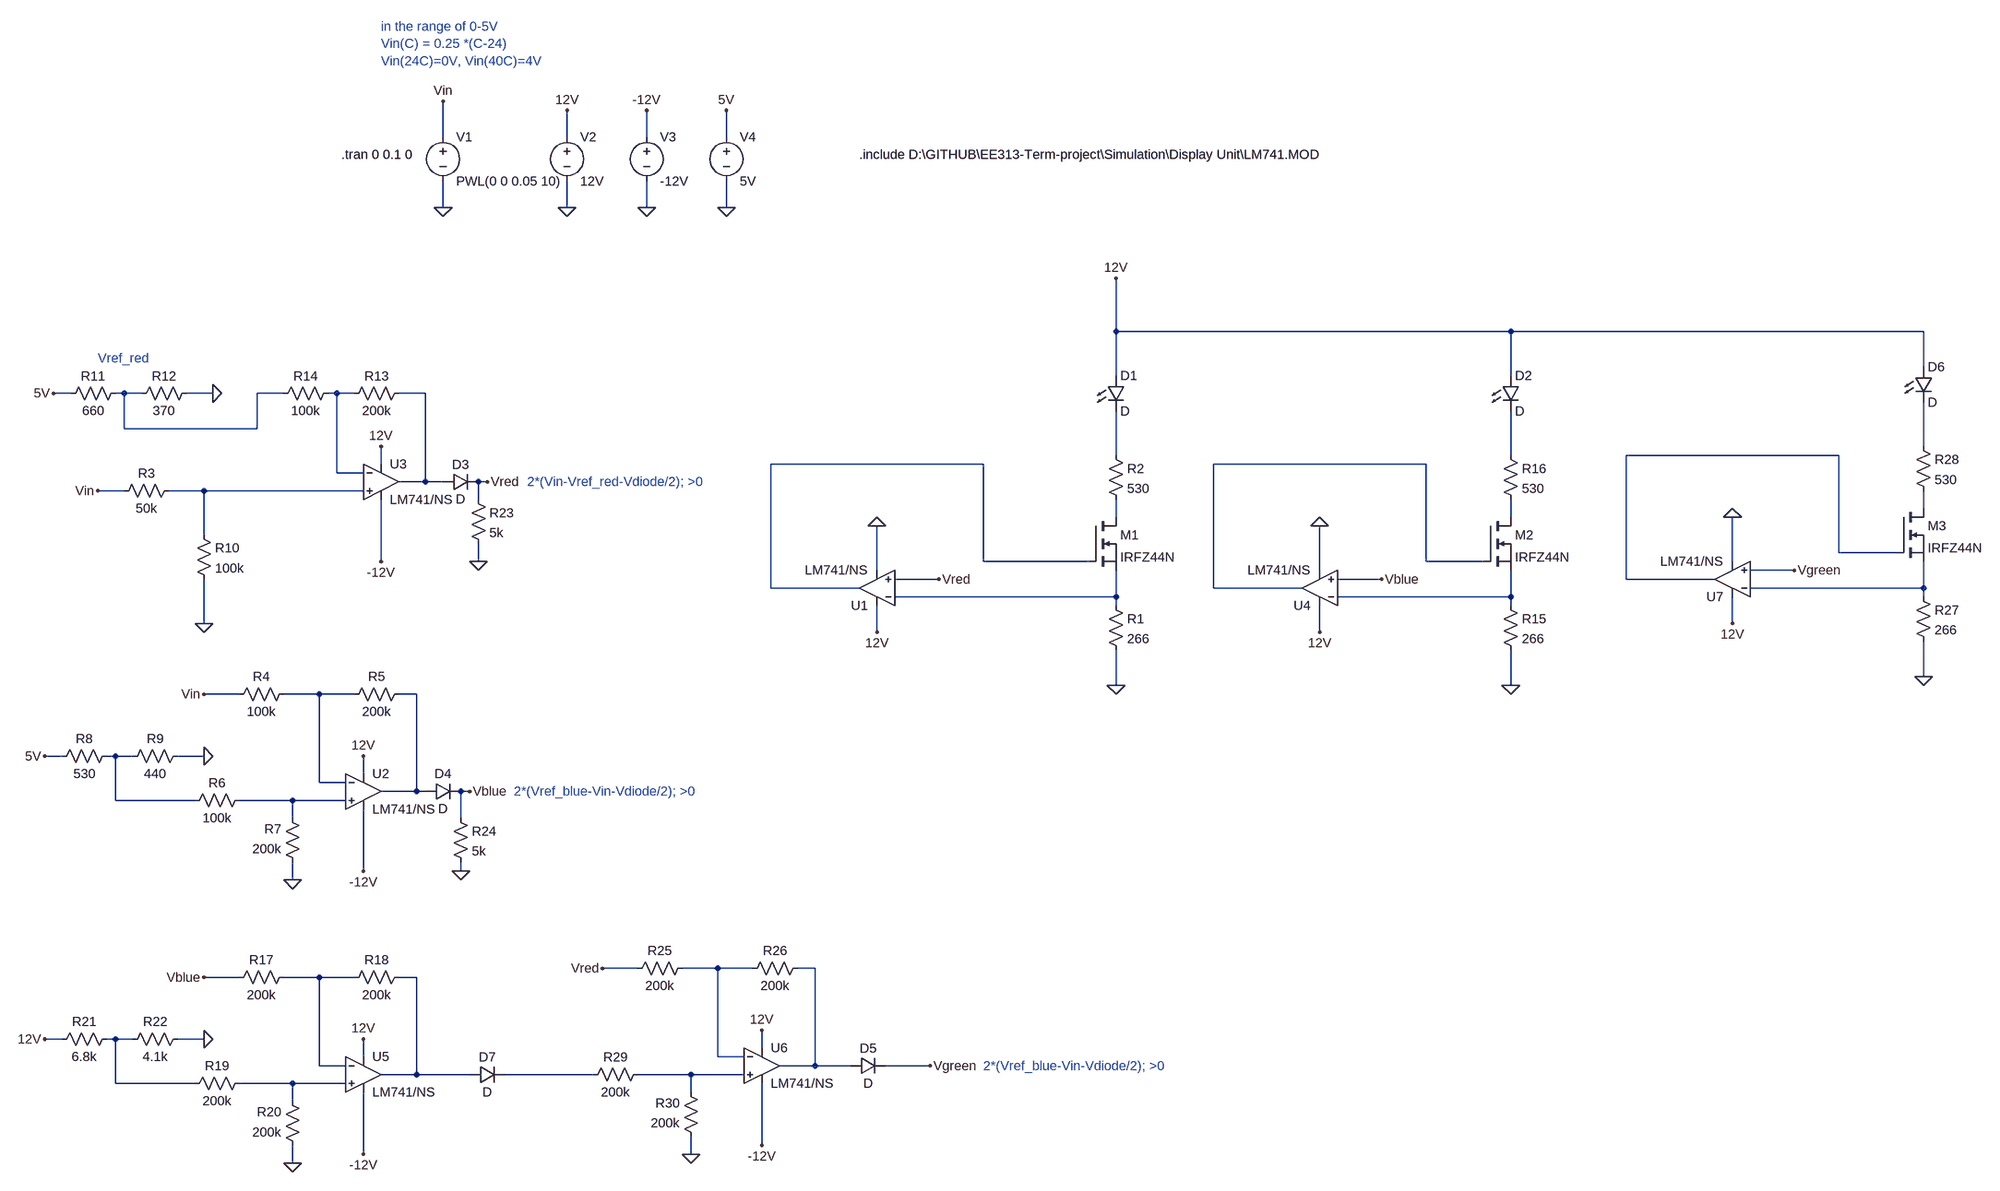
[diagram p0: schematic Display Unit.asc]
Display Unit.asc, the LTspice schematic file:
Version 4
SHEET 1 4272 2752
WIRE -912 320 -912 256
WIRE -688 320 -688 272
WIRE -544 320 -544 272
WIRE -400 320 -400 272
WIRE -912 448 -912 400
WIRE -688 448 -688 400
WIRE -544 448 -544 400
WIRE -400 448 -400 400
WIRE 304 672 304 576
WIRE 1104 672 304 672
WIRE 2000 672 1104 672
WIRE 2000 736 2000 672
WIRE 304 752 304 672
WIRE 1104 752 1104 672
WIRE -1584 784 -1616 784
WIRE -1488 784 -1504 784
WIRE -1456 784 -1488 784
WIRE -1328 784 -1376 784
WIRE -1200 784 -1248 784
WIRE -1104 784 -1120 784
WIRE -1072 784 -1104 784
WIRE -944 784 -992 784
WIRE -1488 848 -1488 784
WIRE -1248 848 -1248 784
WIRE -1248 848 -1488 848
WIRE 2000 880 2000 800
WIRE 304 896 304 816
WIRE 1104 896 1104 816
WIRE 1760 896 1376 896
WIRE -1024 912 -1024 880
WIRE 64 912 -320 912
WIRE 864 912 480 912
WIRE -1104 928 -1104 784
WIRE -1056 928 -1104 928
WIRE -944 944 -944 784
WIRE -944 944 -992 944
WIRE -912 944 -944 944
WIRE -832 944 -848 944
WIRE -1488 960 -1536 960
WIRE -1344 960 -1408 960
WIRE -1056 960 -1344 960
WIRE -848 976 -848 944
WIRE 2000 992 2000 960
WIRE 304 1008 304 976
WIRE 1104 1008 1104 976
WIRE -1344 1040 -1344 960
WIRE 1760 1072 1760 896
WIRE 1952 1072 1760 1072
WIRE -1024 1088 -1024 976
WIRE -848 1088 -848 1056
WIRE 64 1088 64 912
WIRE 256 1088 64 1088
WIRE 864 1088 864 912
WIRE 1056 1088 864 1088
WIRE 1568 1088 1568 1008
WIRE -128 1104 -128 1024
WIRE 672 1104 672 1024
WIRE 1680 1104 1600 1104
WIRE -16 1120 -96 1120
WIRE 784 1120 704 1120
WIRE 1376 1120 1376 896
WIRE 1536 1120 1376 1120
WIRE -320 1136 -320 912
WIRE -160 1136 -320 1136
WIRE 480 1136 480 912
WIRE 640 1136 480 1136
WIRE 2000 1136 2000 1088
WIRE 2000 1136 1600 1136
WIRE 304 1152 304 1104
WIRE 304 1152 -96 1152
WIRE 1104 1152 1104 1104
WIRE 1104 1152 704 1152
WIRE 2000 1152 2000 1136
WIRE 304 1168 304 1152
WIRE 1104 1168 1104 1152
WIRE -1344 1200 -1344 1120
WIRE 1568 1200 1568 1152
WIRE -128 1216 -128 1168
WIRE 672 1216 672 1168
WIRE 2000 1296 2000 1232
WIRE 304 1312 304 1248
WIRE 1104 1312 1104 1248
WIRE -1280 1328 -1344 1328
WIRE -1136 1328 -1200 1328
WIRE -1072 1328 -1136 1328
WIRE -960 1328 -992 1328
WIRE -1600 1440 -1632 1440
WIRE -1504 1440 -1520 1440
WIRE -1472 1440 -1504 1440
WIRE -1344 1440 -1392 1440
WIRE -1056 1472 -1056 1440
WIRE -1136 1488 -1136 1328
WIRE -1088 1488 -1136 1488
WIRE -960 1504 -960 1328
WIRE -960 1504 -1024 1504
WIRE -944 1504 -960 1504
WIRE -864 1504 -880 1504
WIRE -1504 1520 -1504 1440
WIRE -1360 1520 -1504 1520
WIRE -1184 1520 -1280 1520
WIRE -1088 1520 -1184 1520
WIRE -1184 1552 -1184 1520
WIRE -880 1552 -880 1504
WIRE -1056 1648 -1056 1536
WIRE -880 1648 -880 1632
WIRE -1184 1664 -1184 1632
WIRE -560 1824 -624 1824
WIRE -416 1824 -480 1824
WIRE -352 1824 -416 1824
WIRE -240 1824 -272 1824
WIRE -1280 1840 -1344 1840
WIRE -1136 1840 -1200 1840
WIRE -1072 1840 -1136 1840
WIRE -960 1840 -992 1840
WIRE -1600 1952 -1632 1952
WIRE -1504 1952 -1520 1952
WIRE -1472 1952 -1504 1952
WIRE -1344 1952 -1392 1952
WIRE -336 1968 -336 1936
WIRE -1056 1984 -1056 1952
WIRE -416 1984 -416 1824
WIRE -368 1984 -416 1984
WIRE -1136 2000 -1136 1840
WIRE -1088 2000 -1136 2000
WIRE -240 2000 -240 1824
WIRE -240 2000 -304 2000
WIRE -176 2000 -240 2000
WIRE -32 2000 -112 2000
WIRE -960 2016 -960 1840
WIRE -960 2016 -1024 2016
WIRE -864 2016 -960 2016
WIRE -640 2016 -800 2016
WIRE -464 2016 -560 2016
WIRE -368 2016 -464 2016
WIRE -1504 2032 -1504 1952
WIRE -1360 2032 -1504 2032
WIRE -1184 2032 -1280 2032
WIRE -1088 2032 -1184 2032
WIRE -464 2048 -464 2016
WIRE -1184 2064 -1184 2032
WIRE -336 2144 -336 2032
WIRE -1056 2160 -1056 2048
WIRE -464 2160 -464 2128
WIRE -1184 2176 -1184 2144
FLAG -912 448 0
FLAG -912 256 Vin
FLAG -128 1216 12V
FLAG -688 448 0
FLAG -688 272 12V
FLAG 304 576 12V
FLAG 304 1312 0
FLAG -16 1120 Vred
FLAG -544 448 0
FLAG -544 272 -12V
FLAG -400 448 0
FLAG -400 272 5V
FLAG -1024 880 12V
FLAG -1344 1200 0
FLAG -832 944 Vred
FLAG -1616 784 5V
FLAG -1328 784 0
FLAG -1536 960 Vin
FLAG -1056 1440 12V
FLAG -864 1504 Vblue
FLAG -128 1024 0
FLAG 672 1216 12V
FLAG 1104 1312 0
FLAG 784 1120 Vblue
FLAG 672 1024 0
FLAG -1184 1664 0
FLAG -1344 1328 Vin
FLAG -1024 1088 -12V
FLAG -1056 1648 -12V
FLAG -1632 1440 5V
FLAG -1344 1440 0
FLAG 1568 1200 12V
FLAG 2000 1296 0
FLAG 1680 1104 Vgreen
FLAG 1568 1008 0
FLAG -1056 1952 12V
FLAG -32 2000 Vgreen
FLAG -1184 2176 0
FLAG -624 1824 Vred
FLAG -1056 2160 -12V
FLAG -1632 1952 12V
FLAG -1344 1952 0
FLAG -848 1088 0
FLAG -880 1648 0
FLAG -336 1936 12V
FLAG -464 2160 0
FLAG -1344 1840 Vblue
FLAG -336 2144 -12V
SYMBOL voltage -912 304 R0
WINDOW 123 0 0 Left 0
WINDOW 39 0 0 Left 0
SYMATTR InstName V1
SYMATTR Value PWL(0 0 0.05 10)
SYMBOL OpAmps\\opamp2 -128 1200 R180
SYMATTR InstName U1
SYMATTR Value LM741/NS
SYMBOL voltage -688 304 R0
WINDOW 123 0 0 Left 0
WINDOW 39 0 0 Left 0
SYMATTR InstName V2
SYMATTR Value 12V
SYMBOL LED 288 752 R0
SYMATTR InstName D1
SYMBOL res 288 1152 R0
SYMATTR InstName R1
SYMATTR Value 266
SYMBOL res 288 880 R0
SYMATTR InstName R2
SYMATTR Value 530
SYMBOL voltage -544 304 R0
WINDOW 123 0 0 Left 0
WINDOW 39 0 0 Left 0
SYMATTR InstName V3
SYMATTR Value -12V
SYMBOL voltage -400 304 R0
WINDOW 123 0 0 Left 0
WINDOW 39 0 0 Left 0
SYMATTR InstName V4
SYMATTR Value 5V
SYMBOL OpAmps\\opamp2 -1024 880 R0
SYMATTR InstName U3
SYMATTR Value LM741/NS
SYMBOL res -1360 1024 R0
SYMATTR InstName R10
SYMATTR Value 100k
SYMBOL res -976 768 R90
WINDOW 0 0 56 VBottom 2
WINDOW 3 32 56 VTop 2
SYMATTR InstName R13
SYMATTR Value 200k
SYMBOL res -1216 800 R270
WINDOW 0 32 56 VTop 2
WINDOW 3 0 56 VBottom 2
SYMATTR InstName R14
SYMATTR Value 100k
SYMBOL res -1488 768 R90
WINDOW 0 0 56 VBottom 2
WINDOW 3 32 56 VTop 2
SYMATTR InstName R11
SYMATTR Value 660
SYMBOL res -1360 768 R90
WINDOW 0 0 56 VBottom 2
WINDOW 3 32 56 VTop 2
SYMATTR InstName R12
SYMATTR Value 370
SYMBOL res -1392 944 R90
WINDOW 0 0 56 VBottom 2
WINDOW 3 32 56 VTop 2
SYMATTR InstName R3
SYMATTR Value 50k
SYMBOL OpAmps\\opamp2 -1056 1440 R0
SYMATTR InstName U2
SYMATTR Value LM741/NS
SYMBOL nmos 256 1008 R0
SYMATTR InstName M1
SYMATTR Value IRFZ44N
SYMBOL OpAmps\\opamp2 672 1200 R180
SYMATTR InstName U4
SYMATTR Value LM741/NS
SYMBOL LED 1088 752 R0
SYMATTR InstName D2
SYMBOL res 1088 1152 R0
SYMATTR InstName R15
SYMATTR Value 266
SYMBOL res 1088 880 R0
SYMATTR InstName R16
SYMATTR Value 530
SYMBOL nmos 1056 1008 R0
SYMATTR InstName M2
SYMATTR Value IRFZ44N
SYMBOL res -1184 1312 R90
WINDOW 0 0 56 VBottom 2
WINDOW 3 32 56 VTop 2
SYMATTR InstName R4
SYMATTR Value 100k
SYMBOL res -976 1312 R90
WINDOW 0 0 56 VBottom 2
WINDOW 3 32 56 VTop 2
SYMATTR InstName R5
SYMATTR Value 200k
SYMBOL res -1264 1504 R90
WINDOW 0 0 56 VBottom 2
WINDOW 3 32 56 VTop 2
SYMATTR InstName R6
SYMATTR Value 100k
SYMBOL res -1168 1648 R180
WINDOW 0 36 76 Left 2
WINDOW 3 36 40 Left 2
SYMATTR InstName R7
SYMATTR Value 200k
SYMBOL diode -912 960 R270
WINDOW 0 32 32 VTop 2
WINDOW 3 0 32 VBottom 2
SYMATTR InstName D3
SYMBOL diode -944 1520 R270
WINDOW 0 32 32 VTop 2
WINDOW 3 0 32 VBottom 2
SYMATTR InstName D4
SYMBOL res -1504 1424 R90
WINDOW 0 0 56 VBottom 2
WINDOW 3 32 56 VTop 2
SYMATTR InstName R8
SYMATTR Value 530
SYMBOL res -1376 1424 R90
WINDOW 0 0 56 VBottom 2
WINDOW 3 32 56 VTop 2
SYMATTR InstName R9
SYMATTR Value 440
SYMBOL OpAmps\\opamp2 1568 1184 R180
SYMATTR InstName U7
SYMATTR Value LM741/NS
SYMBOL LED 1984 736 R0
SYMATTR InstName D6
SYMBOL res 1984 1136 R0
SYMATTR InstName R27
SYMATTR Value 266
SYMBOL res 1984 864 R0
SYMATTR InstName R28
SYMATTR Value 530
SYMBOL nmos 1952 992 R0
SYMATTR InstName M3
SYMATTR Value IRFZ44N
SYMBOL OpAmps\\opamp2 -1056 1952 R0
SYMATTR InstName U5
SYMATTR Value LM741/NS
SYMBOL res -1184 1824 R90
WINDOW 0 0 56 VBottom 2
WINDOW 3 32 56 VTop 2
SYMATTR InstName R17
SYMATTR Value 200k
SYMBOL res -976 1824 R90
WINDOW 0 0 56 VBottom 2
WINDOW 3 32 56 VTop 2
SYMATTR InstName R18
SYMATTR Value 200k
SYMBOL res -1264 2016 R90
WINDOW 0 0 56 VBottom 2
WINDOW 3 32 56 VTop 2
SYMATTR InstName R19
SYMATTR Value 200k
SYMBOL res -1168 2160 R180
WINDOW 0 36 76 Left 2
WINDOW 3 36 40 Left 2
SYMATTR InstName R20
SYMATTR Value 200k
SYMBOL res -1504 1936 R90
WINDOW 0 0 56 VBottom 2
WINDOW 3 32 56 VTop 2
SYMATTR InstName R21
SYMATTR Value 6.8k
SYMBOL res -1376 1936 R90
WINDOW 0 0 56 VBottom 2
WINDOW 3 32 56 VTop 2
SYMATTR InstName R22
SYMATTR Value 4.1k
SYMBOL res -864 960 R0
SYMATTR InstName R23
SYMATTR Value 5k
SYMBOL res -896 1536 R0
SYMATTR InstName R24
SYMATTR Value 5k
SYMBOL OpAmps\\opamp2 -336 1936 R0
SYMATTR InstName U6
SYMATTR Value LM741/NS
SYMBOL res -464 1808 R90
WINDOW 0 0 56 VBottom 2
WINDOW 3 32 56 VTop 2
SYMATTR InstName R25
SYMATTR Value 200k
SYMBOL res -256 1808 R90
WINDOW 0 0 56 VBottom 2
WINDOW 3 32 56 VTop 2
SYMATTR InstName R26
SYMATTR Value 200k
SYMBOL res -544 2000 R90
WINDOW 0 0 56 VBottom 2
WINDOW 3 32 56 VTop 2
SYMATTR InstName R29
SYMATTR Value 200k
SYMBOL res -448 2144 R180
WINDOW 0 36 76 Left 2
WINDOW 3 36 40 Left 2
SYMATTR InstName R30
SYMATTR Value 200k
SYMBOL diode -176 2016 R270
WINDOW 0 32 32 VTop 2
WINDOW 3 0 32 VBottom 2
SYMATTR InstName D5
SYMBOL diode -864 2032 R270
WINDOW 0 32 32 VTop 2
WINDOW 3 0 32 VBottom 2
SYMATTR InstName D7
TEXT -160 352 Left 2 !.include D:\\GITHUB\\EE313-Term-project\\Simulation\\Display Unit\\LM741.MOD
TEXT -1096 352 Left 2 !.tran 0 0.1 0
TEXT -1024 120 Left 2 ;in the range of 0-5V\nVin(C) = 0.25 *(C-24)\nVin(24C)=0V, Vin(40C)=4V
TEXT -760 944 Left 2 ;2*(Vin-Vref_red-Vdiode/2); >0
TEXT -784 1504 Left 2 ;2*(Vref_blue-Vin-Vdiode/2); >0
TEXT -1536 720 Left 2 ;Vref_red
TEXT 64 2000 Left 2 ;2*(Vref_blue-Vin-Vdiode/2); >0

The netlist it stands for:
* Display Unit.asc
V1 Vin 0 PWL(0 0 0.05 10)
XU1 Vred N015 12V 0 N008 LM741/NS  ; pins In+ In- V+ V- OUT
V2 12V 0 12V
D1 12V N005 D
R1 N015 0 266
R2 N005 N012 530
V3 -12V 0 -12V
V4 5V 0 5V
XU3 N010 N002 12V -12V N003 LM741/NS  ; pins In+ In- V+ V- OUT
R10 N010 0 100k
R13 N003 N002 200k
R14 N001 N002 100k
R11 N001 5V 660
R12 0 N001 370
R3 N010 Vin 50k
XU2 N020 N017 12V -12V N018 LM741/NS  ; pins In+ In- V+ V- OUT
M1 N012 N008 N015 N015 IRFZ44N
XU4 Vblue N016 12V 0 N009 LM741/NS  ; pins In+ In- V+ V- OUT
D2 12V N006 D
R15 N016 0 266
R16 N006 N013 530
M2 N013 N009 N016 N016 IRFZ44N
R4 N017 Vin 100k
R5 N018 N017 200k
R6 N020 N019 100k
R7 0 N020 200k
D3 N003 Vred D
D4 N018 Vblue D
R8 N019 5V 530
R9 0 N019 440
XU7 Vgreen N014 12V 0 N007 LM741/NS  ; pins In+ In- V+ V- OUT
D6 12V N004 D
R27 N014 0 266
R28 N004 N011 530
M3 N011 N007 N014 N014 IRFZ44N
XU5 N028 N023 12V -12V N024 LM741/NS  ; pins In+ In- V+ V- OUT
R17 N023 Vblue 200k
R18 N024 N023 200k
R19 N028 N025 200k
R20 0 N028 200k
R21 N025 12V 6.8k
R22 0 N025 4.1k
R23 Vred 0 5k
R24 Vblue 0 5k
XU6 N027 N021 12V -12V N022 LM741/NS  ; pins In+ In- V+ V- OUT
R25 N021 Vred 200k
R26 N022 N021 200k
R29 N027 N026 200k
R30 0 N027 200k
D5 N022 Vgreen D
D7 N024 N026 D
.model D D
.lib standard.dio
.model NMOS NMOS
.model PMOS PMOS
.lib standard.mos
.include D:\GITHUB\EE313-Term-project\Simulation\Display Unit\LM741.MOD
.tran 0 0.1 0
* in the range of 0-5V
* Vin(C) = 0.25 *(C-24)
* Vin(24C)=0V, Vin(40C)=4V
* 2*(Vin-Vref_red-Vdiode/2); >0
* 2*(Vref_blue-Vin-Vdiode/2); >0
* Vref_red
* 2*(Vref_blue-Vin-Vdiode/2); >0
.backanno
.end